# Altium schematic sheet TLCDDisplay.SchDoc: LiveDesign Evaluation - EvalBoard Tester
size A3; Organization: Altium Limited; Address1: L3, 12a Rodborough Rd; Address2: Frenchs Forest; Address3: NSW; Address4: Australia 2086; DocumentNumber: 13; SheetNumber: 13; SheetTotal: 16
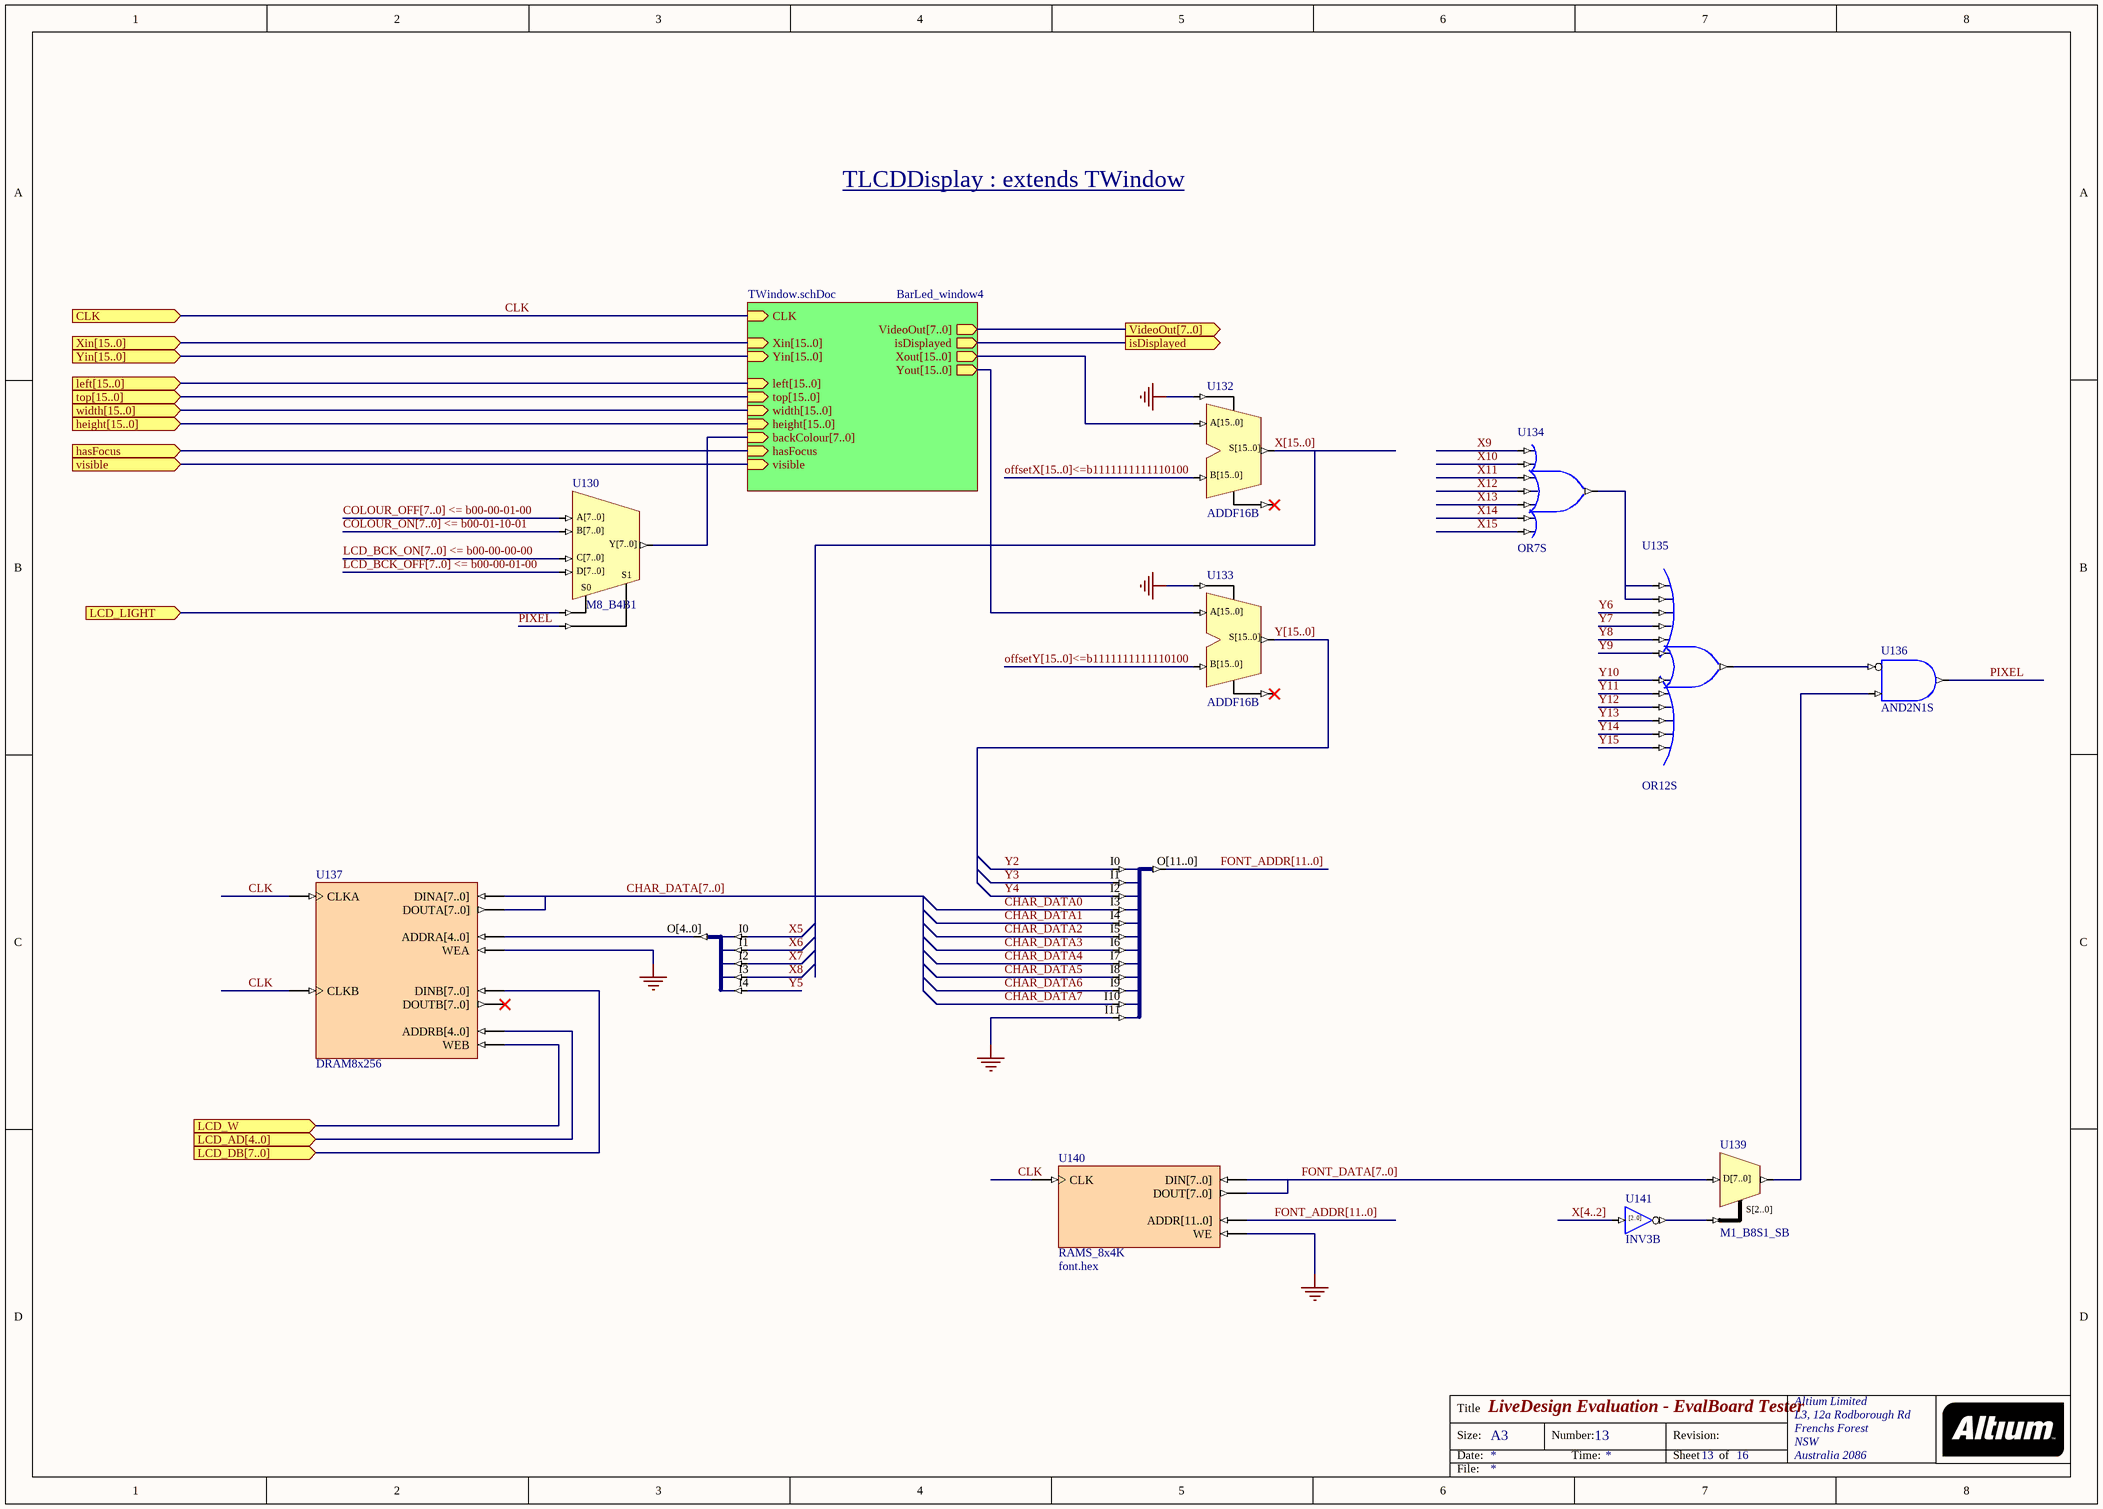
[diagram p0: TLCDDisplay.SchDoc]

## Parts
U130  M8_B4B1
U131  J12S_12B  (value not drawn)
U132  ADDF16B
U133  ADDF16B
U134  OR7S
U135  OR12S
U136  AND2N1S
U137  DRAM8x256
U138  J5S_5B  (value not drawn)
U139  M1_B8S1_SB
U140  RAMS_8x4K  Memory_ContentFile: font.hex
U141  INV3B

## Sub-sheets
BarLed_window4 = TWindow.schDoc: CLK (in), VideoOut[7..0] (out), Xin[15..0] (in), Yin[15..0] (in), top[15..0] (in), width[15..0] (in), height[15..0] (in), left[15..0] (in), Xout[15..0] (out), Yout[15..0] (out), backColour[7..0] (in), isDisplayed (out), visible (in), hasFocus (in)

## Ports
CLK (in), hasFocus (in), height[15..0] (in), isDisplayed (out), LCD_AD[4..0] (in), LCD_DB[7..0] (in), LCD_LIGHT (in), LCD_W (in), left[15..0] (in), top[15..0] (in), VideoOut[7..0] (out), visible (in), width[15..0] (in), Xin[15..0] (in), Yin[15..0] (in)

## Nets
GND: U131.I11 U132.CI U133.CI U137.WEA U140.WE
CHAR_DATA0: U131.I3
CHAR_DATA1: U131.I4
CHAR_DATA2: U131.I5
CHAR_DATA3: U131.I6
CHAR_DATA4: U131.I7
CHAR_DATA5: U131.I8
CHAR_DATA6: U131.I9
CHAR_DATA7: U131.I10
CHAR_DATA[7..0]: U137.DINA[7..0] U137.DOUTA[7..0]
CLK: U137.CLKA U137.CLKB U140.CLK ; port CLK, sheet BarLed_window4/CLK
COLOUR_OFF[7..0] <= b00-00-01-00: U130.A[7..0]
COLOUR_ON[7..0] <= b00-01-10-01: U130.B[7..0]
FONT_ADDR[11..0]: U131.O[11..0] U140.ADDR[11..0]
FONT_DATA[7..0]: U139.D[7..0] U140.DIN[7..0] U140.DOUT[7..0]
hasFocus: port hasFocus, sheet BarLed_window4/hasFocus
isDisplayed: port isDisplayed, sheet BarLed_window4/isDisplayed
LCD_AD[4..0]: U137.ADDRB[4..0] ; port LCD_AD[4..0]
LCD_BCK_OFF[7..0] <= b00-00-01-00: U130.D[7..0]
LCD_BCK_ON[7..0] <= b00-00-00-00: U130.C[7..0]
LCD_DB[7..0]: U137.DINB[7..0] ; port LCD_DB[7..0]
LCD_LIGHT: U130.S0 ; port LCD_LIGHT
LCD_W: U137.WEB ; port LCD_W
offsetX[15..0]<=b1111111111110100: U132.B[15..0]
offsetY[15..0]<=b1111111111110100: U133.B[15..0]
PIXEL: U130.S1 U136.O
visible: port visible, sheet BarLed_window4/visible
X5: U138.I0
X6: U138.I1
X7: U138.I2
X8: U138.I3
X9: U134.I0
X10: U134.I1
X11: U134.I2
X12: U134.I3
X13: U134.I4
X14: U134.I5
X15: U134.I6
X[4..2]: U141.I[2..0]
X[15..0]: U132.S[15..0]
Y2: U131.I0
Y3: U131.I1
Y4: U131.I2
Y5: U138.I4
Y6: U135.I2
Y7: U135.I3
Y8: U135.I4
Y9: U135.I5
Y10: U135.I6
Y11: U135.I7
Y12: U135.I8
Y13: U135.I9
Y14: U135.I10
Y15: U135.I11
Y[15..0]: U133.S[15..0]
NetU130_Y[7..0]: U130.Y[7..0] ; sheet BarLed_window4/backColour[7..0]
NetU132_A[15..0]: U132.A[15..0] ; sheet BarLed_window4/Xout[15..0]
NetU133_A[15..0]: U133.A[15..0] ; sheet BarLed_window4/Yout[15..0]
NetU134_O: U134.O U135.I0 U135.I1
NetU135_O: U135.O U136.I0
NetU136_I1: U136.I1 U139.O
NetU137_ADDRA[4..0]: U137.ADDRA[4..0] U138.O[4..0]
NetU139_S[2..0]: U139.S[2..0] U141.O[2..0]

Not connected (* = marked no-connect by the designer): U132 CO*; U133 CO*; U137 DOUTB[7..0]*

## Buses and harness runs
bus CHAR_DATA[7..0]
bus COLOUR_OFF[7..0] <= b00-00-01-00
bus COLOUR_ON[7..0] <= b00-01-10-01
bus FONT_ADDR[11..0]
bus FONT_DATA[7..0]
bus LCD_BCK_OFF[7..0] <= b00-00-01-00
bus LCD_BCK_ON[7..0] <= b00-00-00-00
bus offsetX[15..0]<=b1111111111110100
bus offsetY[15..0]<=b1111111111110100
bus port height[15..0] = sheet BarLed_window4/height[15..0]
bus port left[15..0] = sheet BarLed_window4/left[15..0]
bus port top[15..0] = sheet BarLed_window4/top[15..0]
bus port VideoOut[7..0] = sheet BarLed_window4/VideoOut[7..0]
bus port width[15..0] = sheet BarLed_window4/width[15..0]
bus port Xin[15..0] = sheet BarLed_window4/Xin[15..0]
bus port Yin[15..0] = sheet BarLed_window4/Yin[15..0]
bus X[4..2]
bus X[15..0]
bus Y[15..0]

## Notes on the sheet
- TLCDDisplay : extends TWindow
- Title
- Size:
- Date:
- A3
- Number:
- Time:
- Revision:
- Sheet
- of
- File:
- (in symbol INV3B) [2..0]

## Library data of the parts
U130 = M8_B4B1: 4x8-Bit Bus to 1x8-Bit Bus Multiplexer; ArchiveName: GENERIC; VHDLIB_SIM: GENERIC_LIB; Published: 29-Jan-2004; Publisher: Altium Limited; Core Revision: 1.00.00
U131 = J12S_12B: 12 Single pin inputs to single 12-Bit output bus; ArchiveName: GENERIC; VHDLIB_SIM: GENERIC_LIB; Published: 29-Jan-2004; Publisher: Altium Limited; Core Revision: 1.00.00
U132 U133 = ADDF16B: 16-Bit Cascadable Unsigned Binary Full Adder, Bus Version; ArchiveName: GENERIC; VHDLIB_SIM: GENERIC_LIB; Published: 31-May-2004; Publisher: Altium Limited; Core Revision: 1.00.00
U134 = OR7S: 7-Input OR Gate, Single Pin Version; Xilinx Equivalent: OR7; ArchiveName: GENERIC; VHDLIB_SIM: GENERIC_LIB; Published: 29-Jan-2004; Publisher: Altium Limited; Core Revision: 1.00.00
U135 = OR12S: 12-Input OR Gate, Single Pin Version; Xilinx Equivalent: OR12; ArchiveName: GENERIC; VHDLIB_SIM: GENERIC_LIB; Published: 29-Jan-2004; Publisher: Altium Limited; Core Revision: 1.00.00
U136 = AND2N1S: 2-Input AND Gate with Active Low A Input, Single Pin Version; Xilinx Equivalent: AND2B1; ArchiveName: GENERIC; VHDLIB_SIM: GENERIC_LIB; Published: 29-Jan-2004; Publisher: Altium Limited; Core Revision: 1.00.00
U137 = RAMD_8x32: Dual Port RAM; Memory_DepthA: 32; Memory_Type: RAM_DualPortBlock; Memory_WidthA: 8; Memory_ClockEdge: Rising; Nexus_Core: Memory_Program; Memory_EnablePin: False; Published: 23/04/2004; Publisher: Altium Hobart Technology Center; Memory_DepthB: 32; Memory_WidthB: 8
U138 = J5S_5B: 5 Single pin inputs to single 5-Bit output bus; ArchiveName: GENERIC; VHDLIB_SIM: GENERIC_LIB; Published: 29-Jan-2004; Publisher: Altium Limited; Core Revision: 1.00.00
U139 = M1_B8S1_SB: 1x8-Bit Bus to 1x1-Single Wire Multiplexer With Bus Version Select; ArchiveName: GENERIC; VHDLIB_SIM: GENERIC_LIB; Published: 31-May-2004; Publisher: Altium Limited; Core Revision: 1.00.00
U140 = RAMS_8x4K: Single Port RAM; Memory_Type: RAM_SinglePortBlock; Memory_ClockEdge: Rising; Nexus_Core: Memory_Program; Memory_Depth: 4096; Memory_Width: 8; Memory_EnablePin: False; Published: 23/04/2004; Publisher: Altium Hobart Technology Center
U141 = INV3B: 3-Bit Inverter, Bus Version; ArchiveName: GENERIC; VHDLIB_SIM: GENERIC_LIB; Published: 29-Jan-2004; Publisher: Altium Limited; Core Revision: 1.00.00